# EAGLE design KeeponNewVersion (EAGLE 6.6.0)
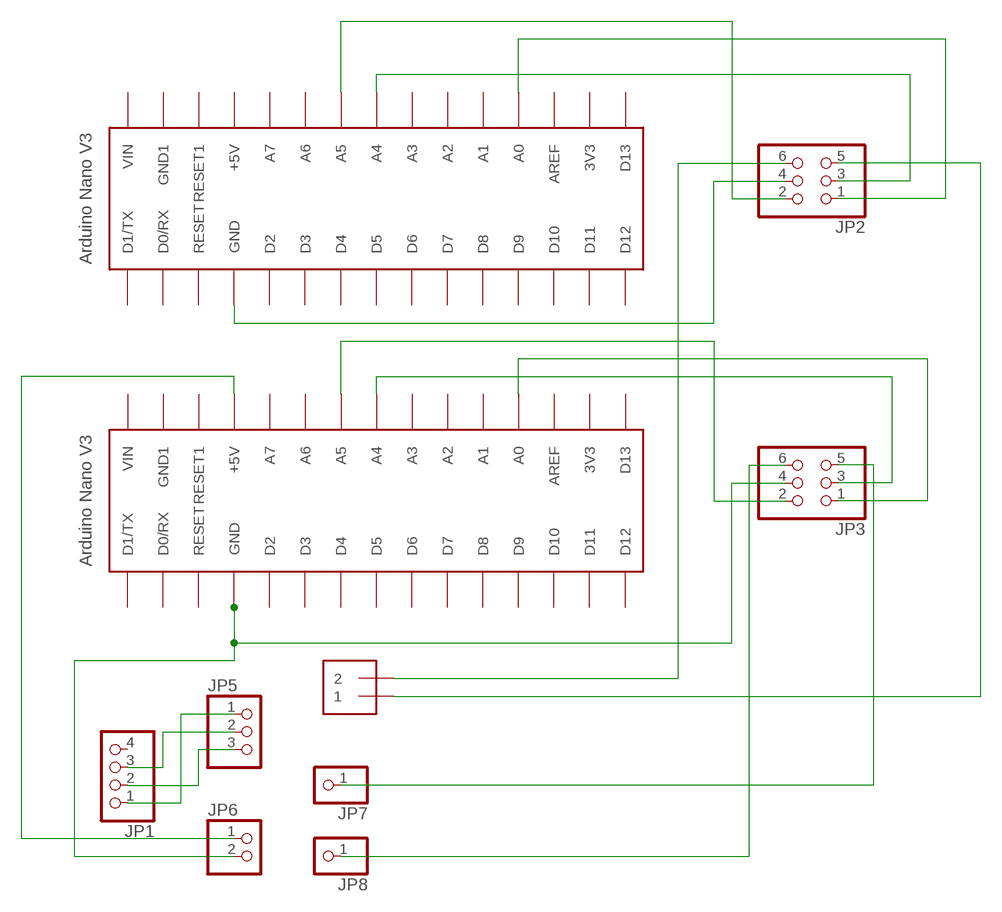
[diagram p0: schematic, sheet 1]

## Parts
J1  1X2-3.5MM  [1X2-3.5MM]
JP1  PINHD-1X4  [1X04]
JP2  PINHD-2X3  [2X03]
JP3  PINHD-2X3  [2X03]
JP5  PINHD-1X3  [1X03]
JP6  PINHD-1X2  [1X02]
JP7  PINHD-1X1  [1X01]
JP8  PINHD-1X1  [1X01]
U$2  ARDUINONANO  [PDIP-32]
U$3  ARDUINONANO  [PDIP-32]

## Nets
GND: JP2.4 JP3.4 JP6.2 U$2.GND U$3.GND
N$1: JP2.1 U$3.A7(A0)
N$2: JP2.2 U$3.A2(A5)
N$3: JP2.3 U$3.A3(A4)
N$5: JP3.1 U$2.A7(A0)
N$6: JP3.3 U$2.A3(A4)
N$7: JP3.2 U$2.A2(A5)
N$9: J1.1 JP2.5
N$10: J1.2 JP2.6
N$11: JP3.5 JP7.1
N$12: JP3.6 JP8.1
N$13: JP1.1 JP5.1
N$14: JP1.2 JP5.3
N$15: JP1.3 JP5.2
N$16: JP6.1 U$2.+5V
Unconnected: JP1.4 U$2.3V3 U$2.A0(A7) U$2.A1(A6) U$2.A4(A3) U$2.A5(A2) U$2.A6(A1) U$2.AREF U$2.D0/RX U$2.D1/TX U$2.D2 U$2.D3 U$2.D4 U$2.D5 U$2.D6 U$2.D7 U$2.D8 U$2.D9 U$2.D10 U$2.D11 U$2.D12 U$2.D13 U$2.GND1 U$2.RESET U$2.RESET1 U$2.VIN U$3.3V3 U$3.+5V U$3.A0(A7) U$3.A1(A6) U$3.A4(A3) U$3.A5(A2) U$3.A6(A1) U$3.AREF U$3.D0/RX U$3.D1/TX U$3.D2 U$3.D3 U$3.D4 U$3.D5 U$3.D6 U$3.D7 U$3.D8 U$3.D9 U$3.D10 U$3.D11 U$3.D12 U$3.D13 U$3.GND1 U$3.RESET U$3.RESET1 U$3.VIN

## Library data of the parts
J1 = adafruit:1X2: 3.5mm Terminal block http://www.ladyada.net/library/pcb/eaglelibrary.html
JP1 = pinhead:PINHD-1X4: PIN HEADER
JP2 JP3 = pinhead:PINHD-2X3: PIN HEADER
JP5 = pinhead:PINHD-1X3: PIN HEADER
JP6 = pinhead:PINHD-1X2: PIN HEADER
JP7 JP8 = pinhead:PINHD-1X1: PIN HEADER
U$2 U$3 = CRE-Lib1:ARDUINONANO: Arduino Nano

## Net classes
0 default: width 0.635 mm, drill 0.635 mm, clearance 0.635 mm

## Board
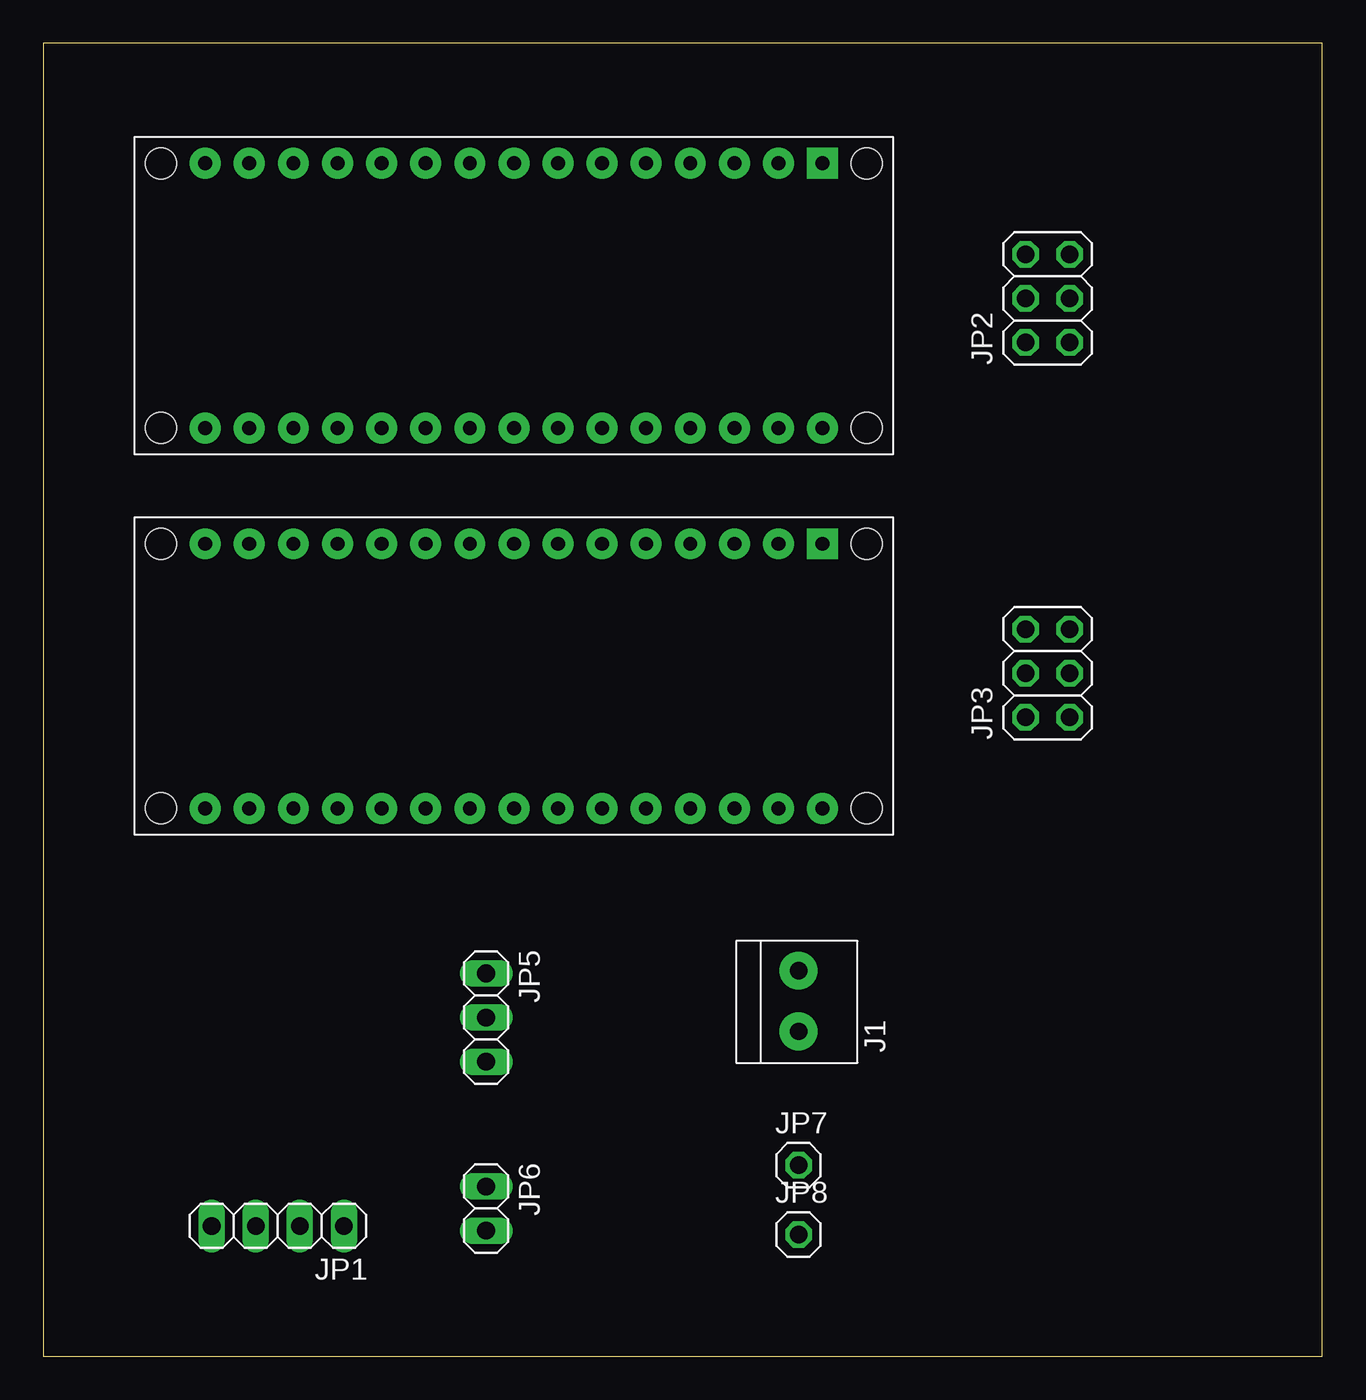
[diagram p1: board, top side]
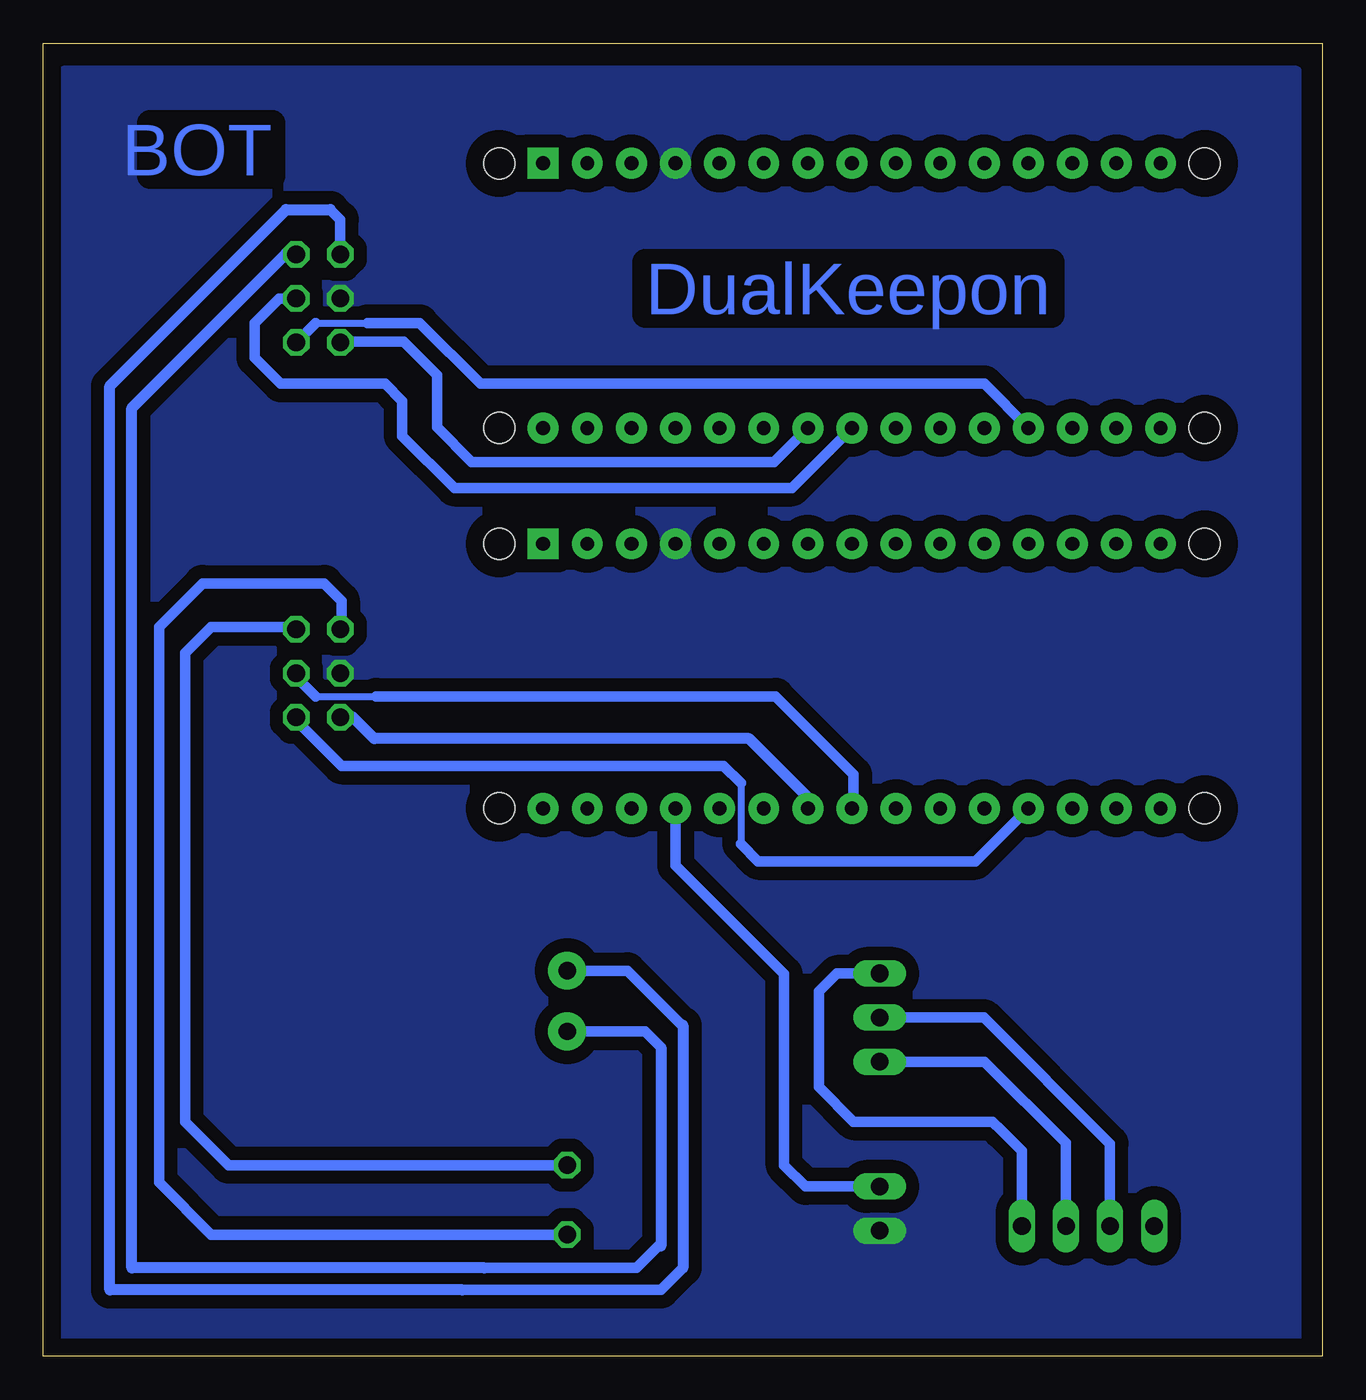
[diagram p2: board, bottom side, seen from below]

Size 73.67 x 75.61 mm. Coordinates in mm from the lower left corner, seen from the top.
Outline: 0,0 73.67,0 73.67,75.61 0,75.61 0,0
Copper layers (1*16): Top 0.035mm / dielectric 1.5mm / Bottom 0.035mm
Design rules "default *": minimum track width 25mil, minimum drill 24mil, track to track 20mil, track to pad 20mil, pad to pad 8mil, via to via 8mil, smd to smd 8mil, copper to edge 40mil, drill to drill 8mil, minimum pad ring 10mil, minimum via ring 8mil, stop-mask expansion 4mil, vias tented up to drill 0mil, thermal gap 10mil

### Footprints (pad centres in the part's own frame; a part is rotated, then mirrored left to right if it is on the bottom)
1X2-3.5MM = drill 1 pad 2.184: 1 1.8,0; 2 -1.7,0
1X04 = drill 1.016 long: 1 -3.81,0; 2 -1.27,0; 3 1.27,0; 4 3.81,0
2X03 = drill 1.016 octagon: 1 -2.54,-1.27; 2 -2.54,1.27; 3 0,-1.27; 4 0,1.27; 5 2.54,-1.27; 6 2.54,1.27
1X03 = drill 1.016 long: 1 -2.54,0; 2 0,0; 3 2.54,0
1X02 = drill 1.016 long: 1 -1.27,0; 2 1.27,0
1X01 = drill 1.016 octagon: 1 0,0
PDIP-32 = drill 0.8 pad 1.778: 3V3 15.24,-35.56; +5V 15.24,-10.16; A0 15.24,-12.7; A1 15.24,-15.24; A2 15.24,-17.78; A3 15.24,-20.32; A4 15.24,-22.86; A5 15.24,-25.4; A6 15.24,-27.94; A7 15.24,-30.48; AREF 15.24,-33.02; D0/RX 0,-5.08; D2 0,-12.7; D3 0,-15.24; D4 0,-17.78; D5 0,-20.32; D6 0,-22.86; D7 0,-25.4; D8 0,-27.94; D9 0,-30.48; D10 0,-33.02; D11 0,-35.56; D12 0,-38.1; D13 15.24,-38.1; GND 0,-10.16; GND1 15.24,-5.08; RESET 0,-7.62; RESET1 15.24,-7.62; VIN 15.24,-2.54 | drill 0.8 pad 1.778 square: D1/TX 0,-2.54 | hole 1.778: 0,0; 0,-40.64; 15.24,-40.64; 15.24,0

### Placement (x,y rotation side)
J1  43.5,20.5 270 top
JP1  13.5,7.5 180 top
JP2  57.84,60.92 90 top
JP3  57.84,39.33 90 top
JP5  25.5,19.5 270 top
JP6  25.5,8.5 270 top
JP7  43.5,11 0 top
JP8  43.5,7 0 top
U$2  47.42,46.79 270 top
U$3  47.42,68.7 270 top

### Tracks (layer width: path | path; a pad name or v marks a point on that pad's centre or on a via)
GND
  pour Bottom (isolate 0.762, no thermals): 1.5,74 72.5,74 73,1 1.5,1
N$1
  Bottom 0.406: 58,59.5 55,59.5
  Bottom 0.61: JP2.1 58,59.5 | U$3.A7 19.48,56 48.5,56 52,59.5 55,59.5
N$2
  Bottom 0.61: 55.88,58.42 52.92,58.42 51,56.5 51,53.5 49,51.5 31.6,51.5 U$3.A2
  Bottom 0.635: 55.88,58.42 JP2.2 | 29.21,53.34 U$3.A2
N$3
  Bottom 0.61: JP2.3 60.08,60.92 61.5,59.5 61.5,57.5 60,56 54,56 53,55 53,53 50,50 30.56,50 30.53,50.03 U$3.A3
N$5
  Bottom 0.406: 33.5,33 33.5,29.5
  Bottom 0.61: JP3.1 59.11,36.61 56.5,34 34.5,34 33.5,33 | 33.5,29.5 32.5,28.5 19.99,28.5 U$2.A7
N$6
  Bottom 0.406: 58,38 54.5,38
  Bottom 0.61: JP3.3 59.11,39.11 58,38 | 54.5,38 31.5,38 27,33.5 27,31.65 U$2.A3
N$7
  Bottom 0.635: JP3.2 55.88,36.83 54.61,35.56 33.02,35.56 29.21,31.75 U$2.A2
N$9
  Bottom 0.61: 48.26,5.08 39.52,5.08 38.1,6.5 | J1.1 39.02,18.7 38.1,17.78
  Bottom 0.635: 48.26,5.08 68.58,5.08 68.58,54.61 59.69,63.5 JP2.5 | 38.1,17.78 38.1,6.5 38.1,6.35
N$10
  Bottom 0.61: 49.53,3.81 38.1,3.81 36.83,5.08 | J1.2 40.03,22.2 36.83,19 | JP2.6 56.57,65.46 57.15,66.04
  Bottom 0.635: 57.15,66.04 59.69,66.04 69.85,55.88 69.85,3.81 49.53,3.81 | 36.83,19.05 36.83,19 36.83,5.08
N$11
  Bottom 0.61: JP7.1 63,11 65.5,13.5 65.5,40.5 64,42 59.24,42 JP3.5
N$12
  Bottom 0.61: JP8.1 64,7 67,10 67,42 64.5,44.5 57.5,44.5 56.5,43.5 56.5,41.94 JP3.6
N$13
  Bottom 0.61: JP5.1 27.96,22.04 29,21 29,15.5 27,13.5 19,13.5 18.5,13 17.31,11.81 JP1.1
N$14
  Bottom 0.61: JP5.3 19.46,16.96 14.77,12.27 JP1.2
N$15
  Bottom 0.61: JP5.2 19.5,19.5 12.23,12.23 JP1.3
N$16
  Bottom 0.61: JP6.1 29.77,9.77 31,11 31,22 37.26,28.26 U$2.+5V

### Text on the board
Bottom: BOT | DualKeepon